# Altium schematic sheet Main MCU.SchDoc
size 431 x 279 mm; SheetNumber: 1; SheetTotal: 2
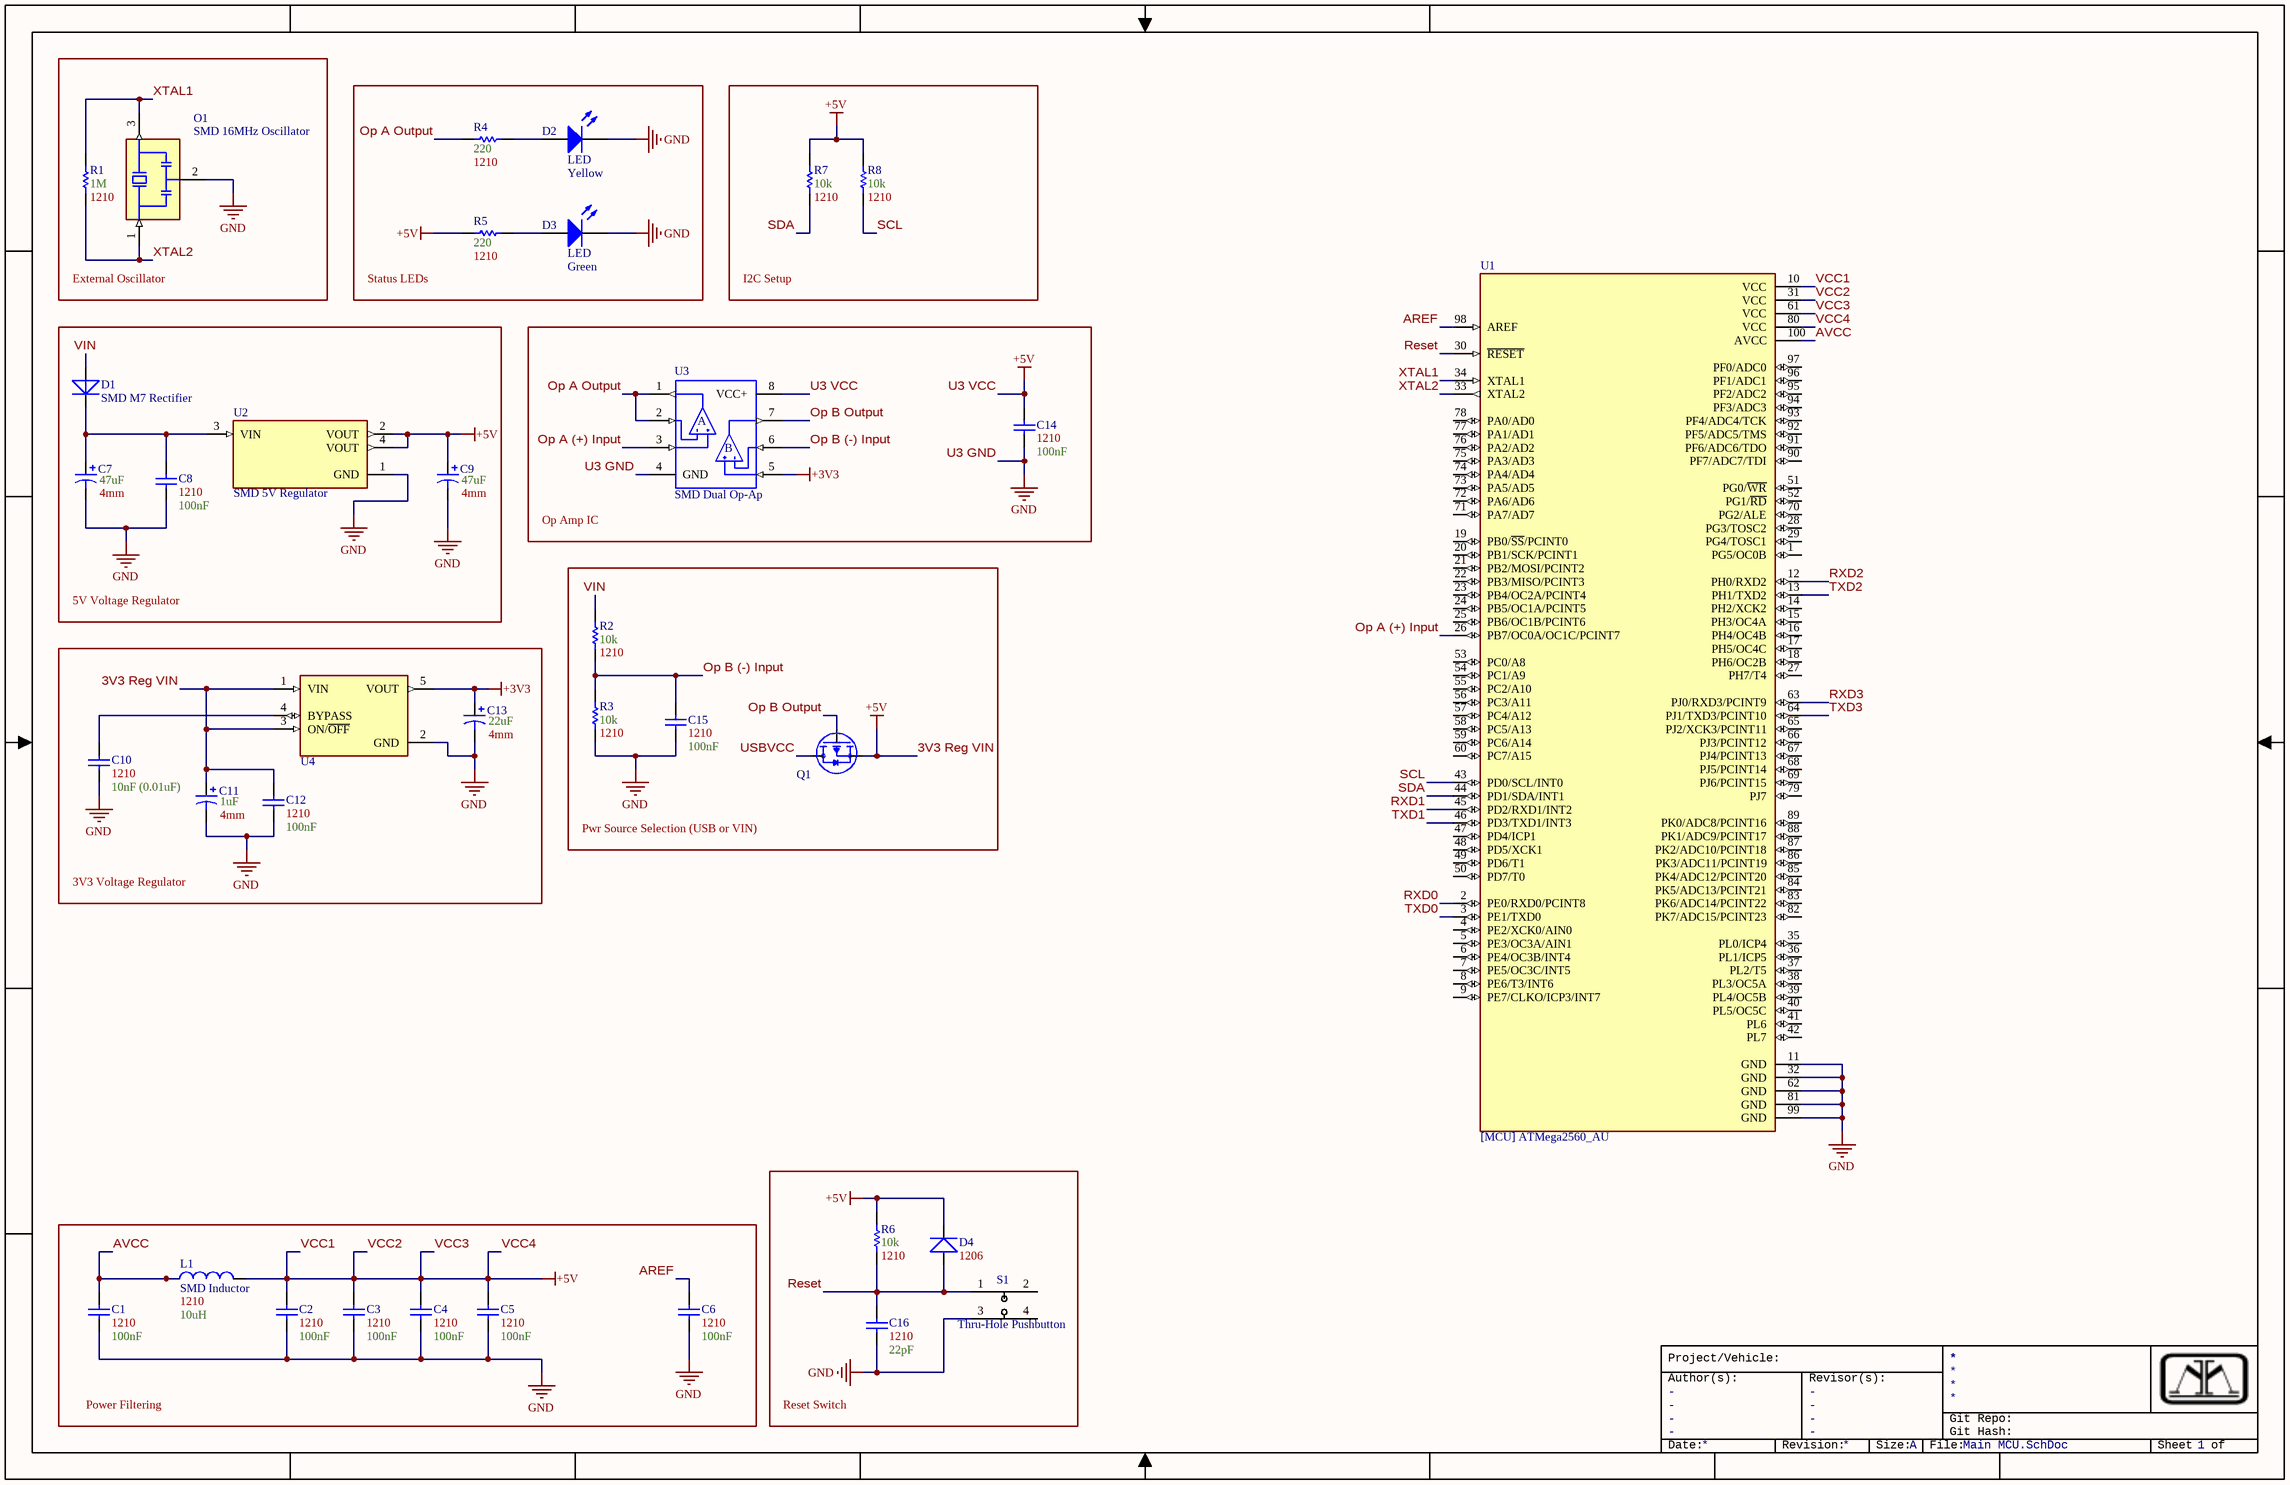
[diagram p0: Main MCU.SchDoc]

## Parts
C1  Size Package: 1210  Capacitance: 100nF  [SMD Capacitor [1210]]  (hidden comment: SMD Capacitor)
C2  Size Package: 1210  Capacitance: 100nF  [SMD Capacitor [1210]]  (hidden comment: SMD Capacitor)
C3  Size Package: 1210  Capacitance: 100nF  [SMD Capacitor [1210]]  (hidden comment: SMD Capacitor)
C4  Size Package: 1210  Capacitance: 100nF  [SMD Capacitor [1210]]  (hidden comment: SMD Capacitor)
C5  Size Package: 1210  Capacitance: 100nF  [SMD Capacitor [1210]]  (hidden comment: SMD Capacitor)
C6  Size Package: 1210  Capacitance: 100nF  [SMD Capacitor [1210]]  (hidden comment: SMD Capacitor)
C7  Capacitance: 47uF  Diameter: 4mm  [SMD Cap - Polarized, 4mm]  (hidden comment: SMD Cap - Polarized)
C8  Size Package: 1210  Capacitance: 100nF  [SMD Capacitor [1210]]  (hidden comment: SMD Capacitor)
C9  Capacitance: 47uF  Diameter: 4mm  [SMD Cap - Polarized, 4mm]  (hidden comment: SMD Cap - Polarized)
C10  Size Package: 1210  Capacitance: 10nF (0.01uF)  [SMD Capacitor [1210]]  (hidden comment: SMD Capacitor)
C11  Capacitance: 1uF  Diameter: 4mm  [SMD Cap - Polarized, 4mm]  (hidden comment: SMD Cap - Polarized)
C12  Size Package: 1210  Capacitance: 100nF  [SMD Capacitor [1210]]  (hidden comment: SMD Capacitor)
C13  Capacitance: 22uF  Diameter: 4mm  [SMD Cap - Polarized, 4mm]  (hidden comment: SMD Cap - Polarized)
C14  Size Package: 1210  Capacitance: 100nF  [SMD Capacitor [1210]]  (hidden comment: SMD Capacitor)
C15  Size Package: 1210  Capacitance: 100nF  [SMD Capacitor [1210]]  (hidden comment: SMD Capacitor)
C16  Size Package: 1210  Capacitance: 22pF  [SMD Capacitor [1210]]  (hidden comment: SMD Capacitor)
D1  SMD M7 Rectifier  [SMD M7 Rectifier]
D2  LED  Color: Yellow  [Small Yellow LED]
D3  LED  Color: Green  [Small Green LED]
D4  Size Package: 1206  [SMD Diode [1206]]  (hidden comment: SMD Diode)
L1  SMD Inductor  Size Package: 1210  Inductance: 10uH  [SMD Inductor [0603]]
O1  SMD 16MHz Oscillator  [SMD 16MHz Oscillator [1]]
Q1  SMD Mosfet (Part #: PMV48XP)  [SMD Mosfet (Part #: PMV48XP)]  (value not drawn)
R1  Resistance: 1M  Size Package: 1210  [SMD Resistor [1210]]  (hidden comment: SMD Resistor)
R2  Resistance: 10k  Size Package: 1210  [SMD Resistor [1210]]  (hidden comment: SMD Resistor)
R3  Resistance: 10k  Size Package: 1210  [SMD Resistor [1210]]  (hidden comment: SMD Resistor)
R4  Resistance: 220  Size Package: 1210  [SMD Resistor [1210]]  (hidden comment: SMD Resistor)
R5  Resistance: 220  Size Package: 1210  [SMD Resistor [1210]]  (hidden comment: SMD Resistor)
R6  Resistance: 10k  Size Package: 1210  [SMD Resistor [1210]]  (hidden comment: SMD Resistor)
R7  Resistance: 10k  Size Package: 1210  [SMD Resistor [1210]]  (hidden comment: SMD Resistor)
R8  Resistance: 10k  Size Package: 1210  [SMD Resistor [1210]]  (hidden comment: SMD Resistor)
S1  Thru-Hole Pushbutton  [Thru-Hole Pushbutton]
U1  [MCU] ATMega2560_AU  [SMD ATMega2560_AU]
U2  SMD 5V Regulator  [SMD 5V Regulator]
U3  SMD Dual Op-Ap  [SMD Dual Op-Ap (LMV358IDGKR)]
U4  SMD 3V3 Regulator  [SMD 3V3 Regulator]  (value not drawn)

## Blocks framed on the sheet
External Oscillator: O1 R1
Status LEDs: D2 D3 R4 R5
I2C Setup: R7 R8
5V Voltage Regulator: C7-C9 D1 U2
Op Amp IC: C14 U3
Pwr Source Selection (USB or VIN): C15 Q1 R2 R3
3V3 Voltage Regulator: C10-C13 U4
Reset Switch: C16 D4 R6 S1
Power Filtering: C1-C6 L1

## Nets
3V3 Reg VIN: C2.2 C3.2 C4.2 C5.2 C9.1 C11.1 C12.2 C14.2 D4.C L1.2 Q1.2(S) R5.2 R6.2 R7.2 R8.2 U1.10(VCC) U1.31(VCC) U1.61(VCC) U1.80(VCC) U2.2(VOUT) U2.4(VOUT) U3.8(VCC+) U4.1(VIN) U4.3(ON/~{OFF})  [also labelled +5V, U3 VCC, VCC1, VCC2, VCC3, VCC4]
+3V3: C13.1 U3.5(2IN+) U4.5(VOUT)
U3 GND: C1.1 C2.1 C3.1 C4.1 C5.1 C6.1 C7.2 C8.1 C9.2 C10.1 C11.2 C12.1 C13.2 C14.1 C15.1 C16.1 D2.2(K) D3.2(K) O1.2(GND) R3.1 S1.3 U1.11(GND) U1.32(GND) U1.62(GND) U1.81(GND) U1.99(GND) U2.1(GND) U3.4(GND) U4.2(GND)  [also labelled GND]
AREF: C6.2 U1.98(AREF)
AVCC: C1.2 L1.1 U1.100(AVCC)
Op A (+) Input: U1.26(PB7/OC0A/OC1C/PCINT7) U3.3(1IN+)
Op A Output: R4.2 U3.1(1OUT) U3.2(1IN-)
Op B (-) Input: C15.2 R2.1 R3.2 U3.6(2IN-)
Op B Output: Q1.1(G) U3.7(2OUT)
Reset: C16.2 D4.A R6.1 S1.1 U1.30(~{RESET})
RXD0: U1.2(PE0/RXD0/PCINT8)
RXD1: U1.45(PD2/RXD1/INT2)
RXD2: U1.12(PH0/RXD2)
RXD3: U1.63(PJ0/RXD3/PCINT9)
SCL: R8.1 U1.43(PD0/SCL/INT0)
SDA: R7.1 U1.44(PD1/SDA/INT1)
TXD0: U1.3(PE1/TXD0)
TXD1: U1.46(PD3/TXD1/INT3)
TXD2: U1.13(PH1/TXD2)
TXD3: U1.64(PJ1/TXD3/PCINT10)
USBVCC: Q1.3(D)
VIN: D1.A R2.2
XTAL1: O1.3(OUT) R1.2 U1.34(XTAL1)
XTAL2: O1.1(IN) R1.1 U1.33(XTAL2)
NetC7_1: C7.1 C8.2 D1.C U2.3(VIN)
NetC10_2: C10.2 U4.4(BYPASS)
NetD2_1: D2.1(A) R4.1
NetD3_1: D3.1(A) R5.1

Not connected (* = marked no-connect by the designer): S1 2 4; U1 1(PG5/OC0B) 4(PE2/XCK0/AIN0) 5(PE3/OC3A/AIN1) 6(PE4/OC3B/INT4) 7(PE5/OC3C/INT5) 8(PE6/T3/INT6) 9(PE7/CLKO/ICP3/INT7) 14(PH2/XCK2) 15(PH3/OC4A) 16(PH4/OC4B) 17(PH5/OC4C) 18(PH6/OC2B) 19(PB0/~{SS}/PCINT0) 20(PB1/SCK/PCINT1) 21(PB2/MOSI/PCINT2) 22(PB3/MISO/PCINT3) 23(PB4/OC2A/PCINT4) 24(PB5/OC1A/PCINT5) 25(PB6/OC1B/PCINT6) 27(PH7/T4) 28(PG3/TOSC2) 29(PG4/TOSC1) 35(PL0/ICP4) 36(PL1/ICP5) 37(PL2/T5) 38(PL3/OC5A) 39(PL4/OC5B) 40(PL5/OC5C) 41(PL6) 42(PL7) 47(PD4/ICP1) 48(PD5/XCK1) 49(PD6/T1) 50(PD7/T0) 51(PG0/~{WR}) 52(PG1/~{RD}) 53(PC0/A8) 54(PC1/A9) 55(PC2/A10) 56(PC3/A11) 57(PC4/A12) 58(PC5/A13) 59(PC6/A14) 60(PC7/A15) 65(PJ2/XCK3/PCINT11) 66(PJ3/PCINT12) 67(PJ4/PCINT13) 68(PJ5/PCINT14) 69(PJ6/PCINT15) 70(PG2/ALE) 71(PA7/AD7) 72(PA6/AD6) 73(PA5/AD5) 74(PA4/AD4) 75(PA3/AD3) 76(PA2/AD2) 77(PA1/AD1) 78(PA0/AD0) 79(PJ7) 82(PK7/ADC15/PCINT23) 83(PK6/ADC14/PCINT22) 84(PK5/ADC13/PCINT21) 85(PK4/ADC12/PCINT20) 86(PK3/ADC11/PCINT19) 87(PK2/ADC10/PCINT18) 88(PK1/ADC9/PCINT17) 89(PK0/ADC8/PCINT16) 90(PF7/ADC7/TDI) 91(PF6/ADC6/TDO) 92(PF5/ADC5/TMS) 93(PF4/ADC4/TCK) 94(PF3/ADC3) 95(PF2/ADC2) 96(PF1/ADC1) 97(PF0/ADC0)

## Notes on the sheet
- Project/Vehicle:
- Author(s):
- -
- Revisor(s):
- Git Repo:
- Git Hash:
- Date:
- Revision:
- Size:
- A
- File:
- Sheet
- of
- (in symbol SMD Dual Op-Ap) A; B

## Library data of the parts
C7 C9 C11 C13 = SMD Cap - Polarized: Diameter: 4mm; JLC Part #: *
  C7 C9: Mouser Part #: 80-EDH476M6R3A9BAA
  C11: Mouser Part #: 80-EXV105M050A9BAA
  C13: Mouser Part #: 667-EEE-FN1C220R
D1 = SMD M7 Rectifier: JLC Part #: C95872
D2 D3 = Small LED: 3mm LED
D4 = SMD Diode: Part #: CD1206-S01575 / JLC Part #: C75465; JLC Part #: C75465
O1 = SMD 16MHz Oscillator [1]: Part #: CSTNE16M0V530000R0 / JLC Part #: C341521; JLC Part #: C341521
Q1 = SMD Mosfet (Part #: PMV48XP): JLC Part #: C2959854
R1-R8 = SMD Resistor: JLC Part #: C728401 / (for 1M Ohm Res)
  R1: JLC Part #: C728401; Mouser Part #: 71-CRCW12101M00FKEAH
  R2 R3 R6-R8: Mouser Part #: 71-CRCW121010K0JNAIF
  R4 R5: Mouser Part #: 71-CRCW1210220RJNEAH
S1 = Thru-Hole Pushbutton: Tactile 4pin SPST Pushbutton / (what I expect is a regular pushbutton)
U1 = [MCU] ATMega2560_AU: JLC Part #: C22460
U2 = SMD 5V Regulator: Part #: LD1117S50CTR / JLC Part #: C81157; JLC Part #: C81157
U3 = SMD Dual Op-Ap: Part #: LMV358IDGKR; JLC Part #: C105242
U4 = SMD 3V3 Regulator: Part #: LP2985-33DBVR / JLC Part #: C95414; JLC Part #: C95414; Mouser Part #: 595-LP2985-33DBVR
C1-C6 C8 C10 C12 C14-C16 = SMD Capacitor: JLC Part #: *
  C1-C6 C8 C12 C14 C15: Mouser Part #: 581-12107C104KAT2A
  C10: Mouser Part #: 810-CGA6P1C0G3B103G2
L1 = SMD Inductor: JLC Part #: *; Mouser Part #: 963-LBC3225T100KR